# EasyEDA Pro project ProPrj_Xen_2025-02-04.epro, schematic Schematic1_2

## Sheets
1 Multiplex: Board Name: XenController; Create Date: 2024-12-16; Page Name: Multiplex; Project Name: Xen; Schematic Name: Schematic1; Update Date: 2024-12-22; Company: EasyEDA.com; Drawn: EasyEDA; Page Size: A4; Part Number: JLCPCB-002; Reviewed: EasyEDA; Version: V0.1
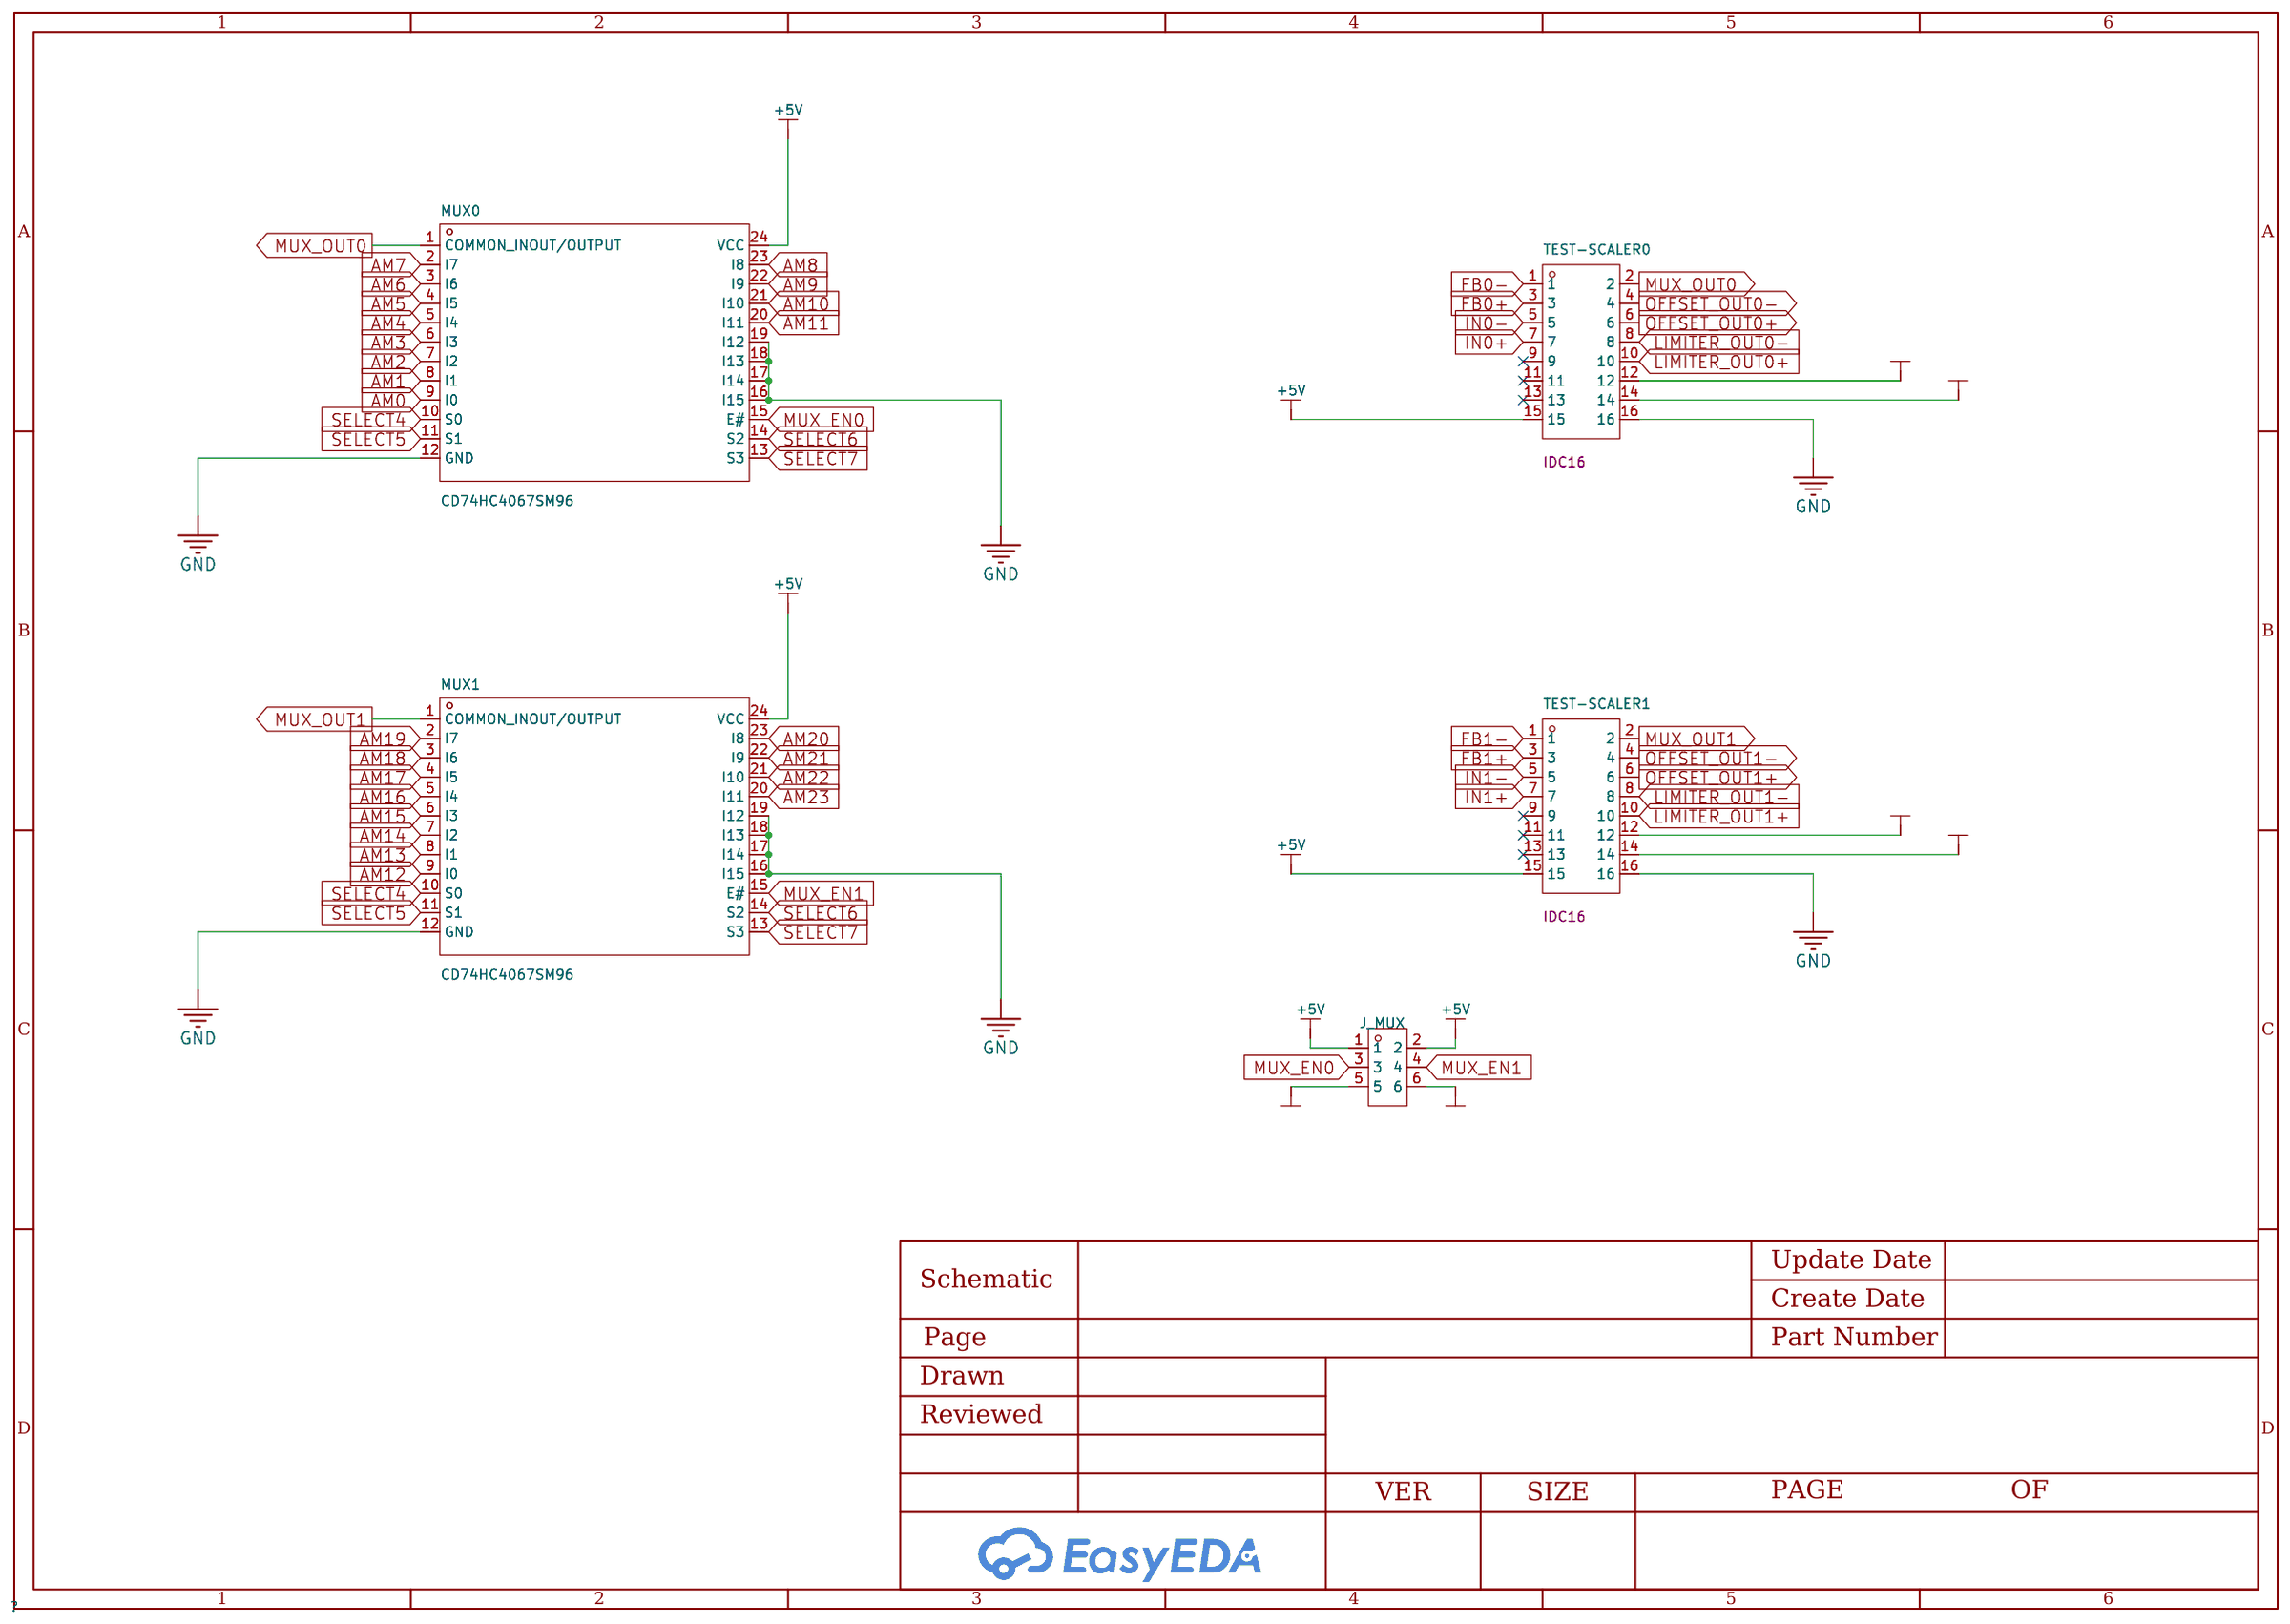
[diagram p0: Multiplex]
2 Scaler: Board Name: XenScaler; Page Name: Scaler
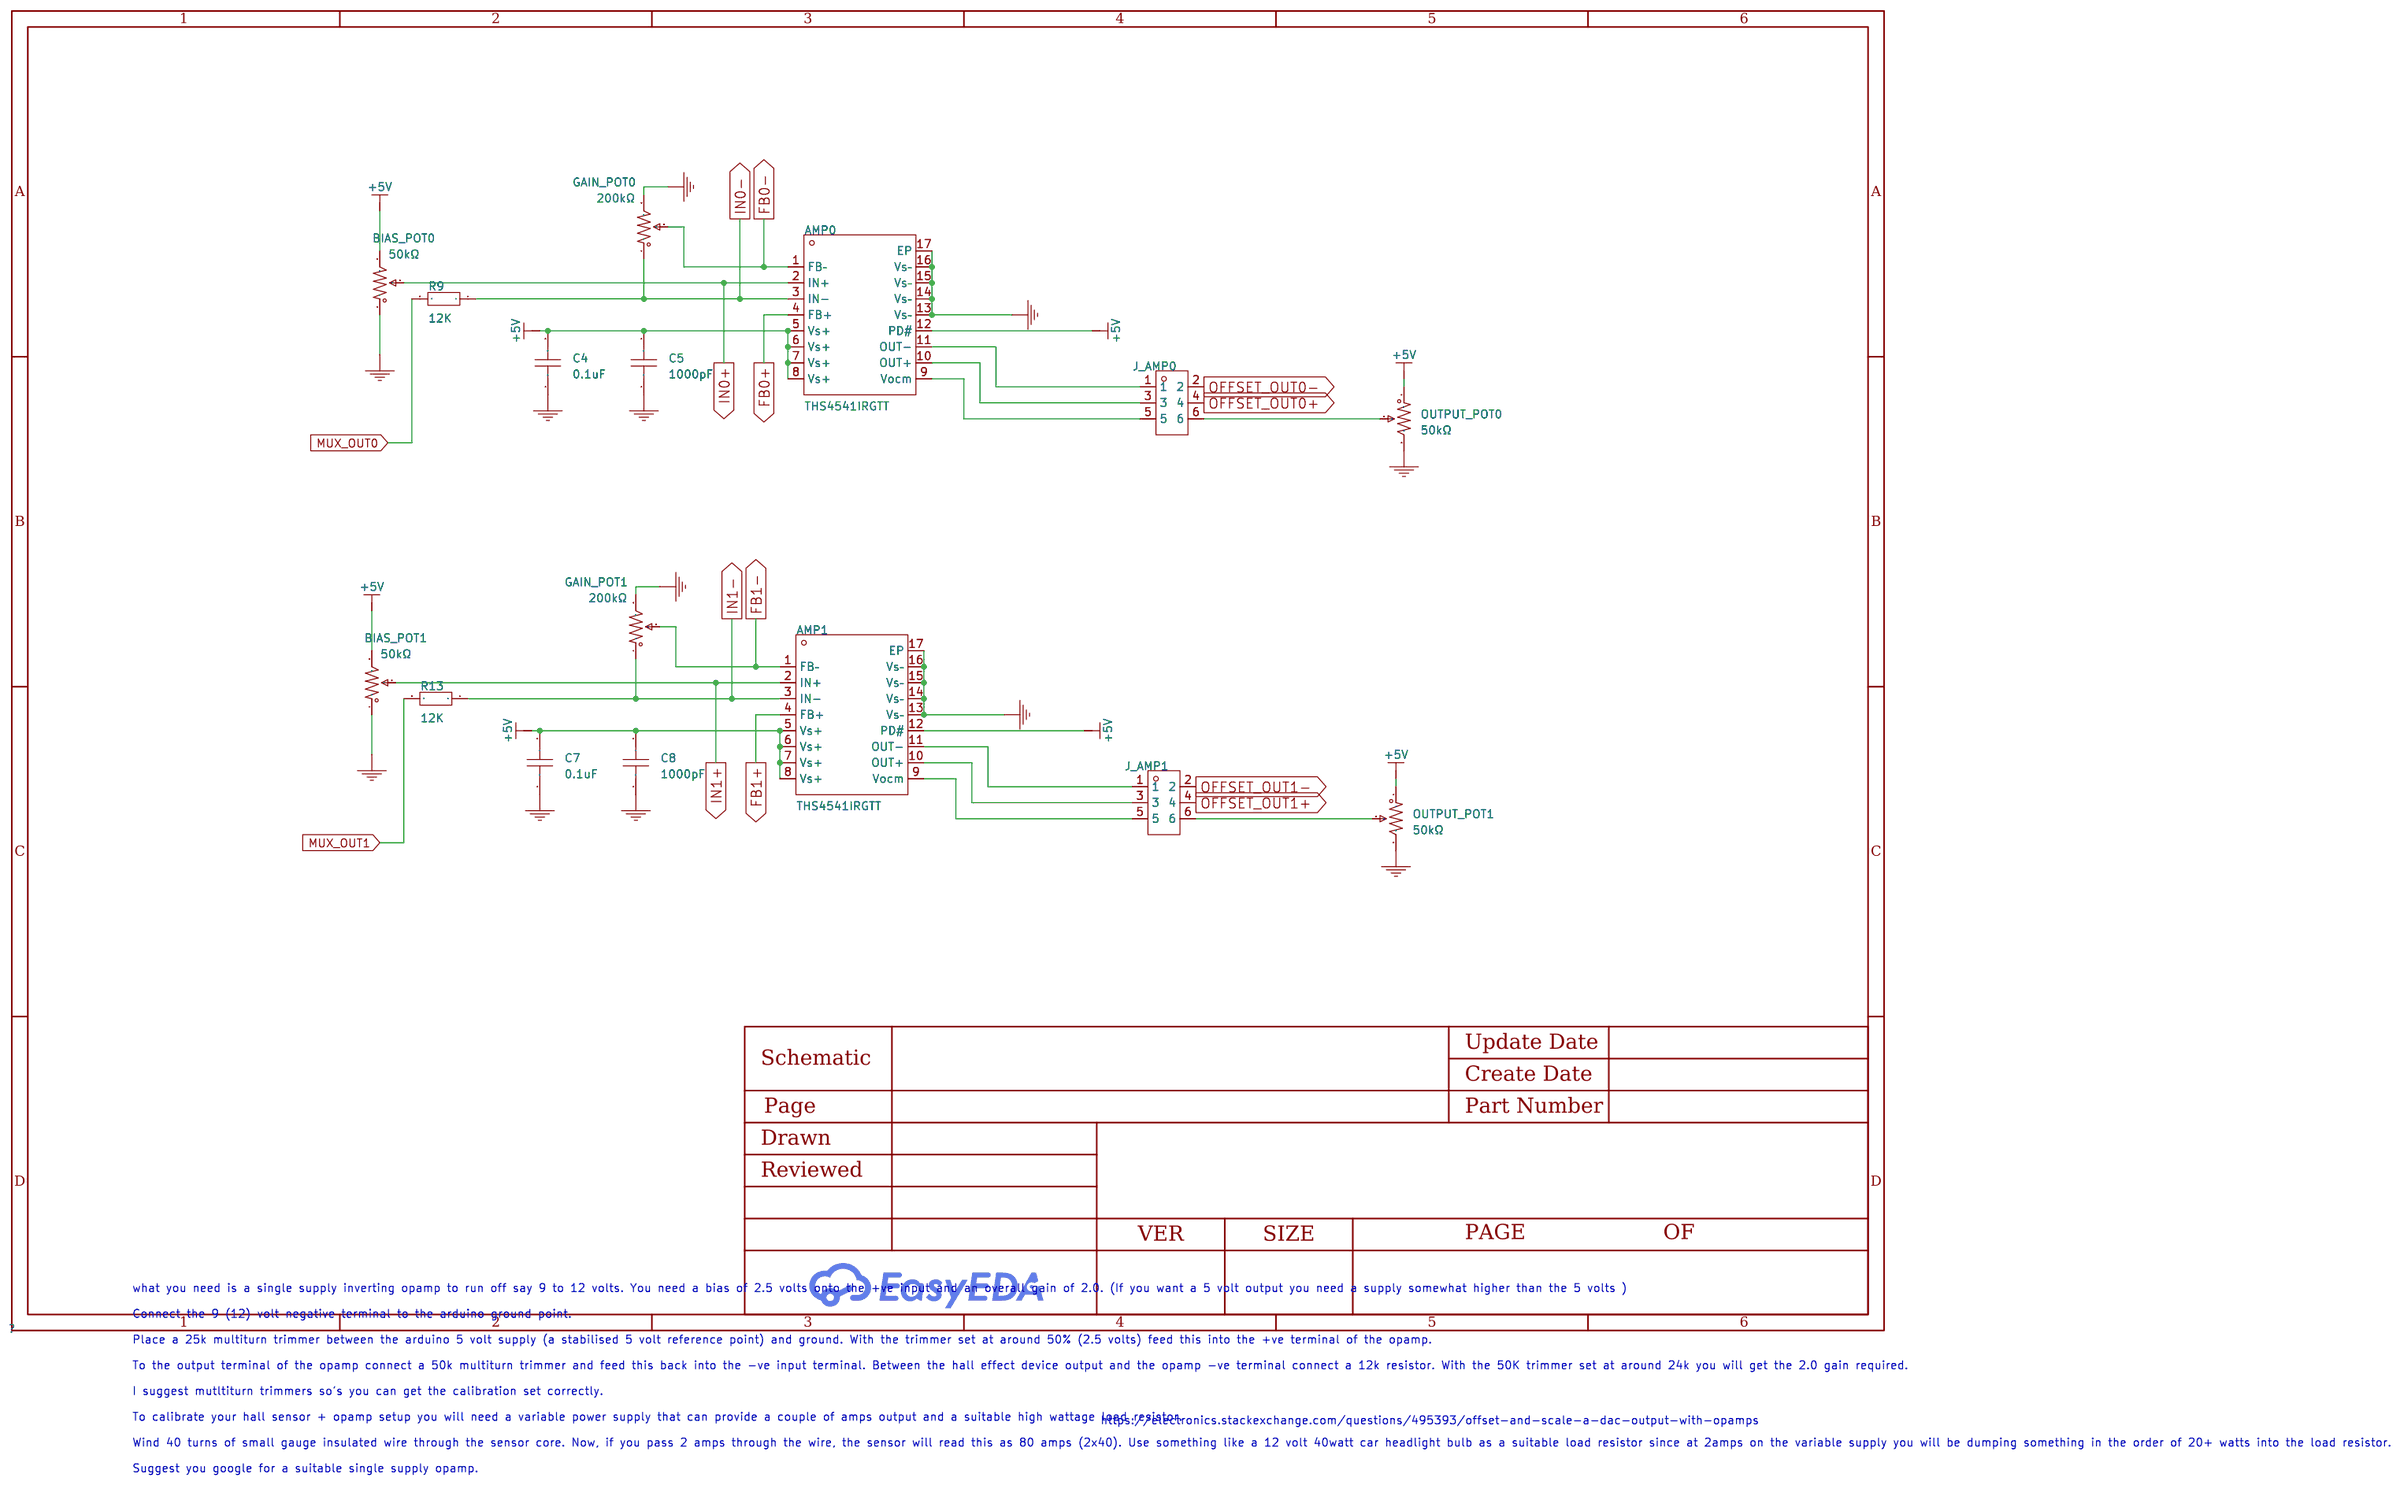
[diagram p1: Scaler]
3 Limiter: Page Name: Limiter
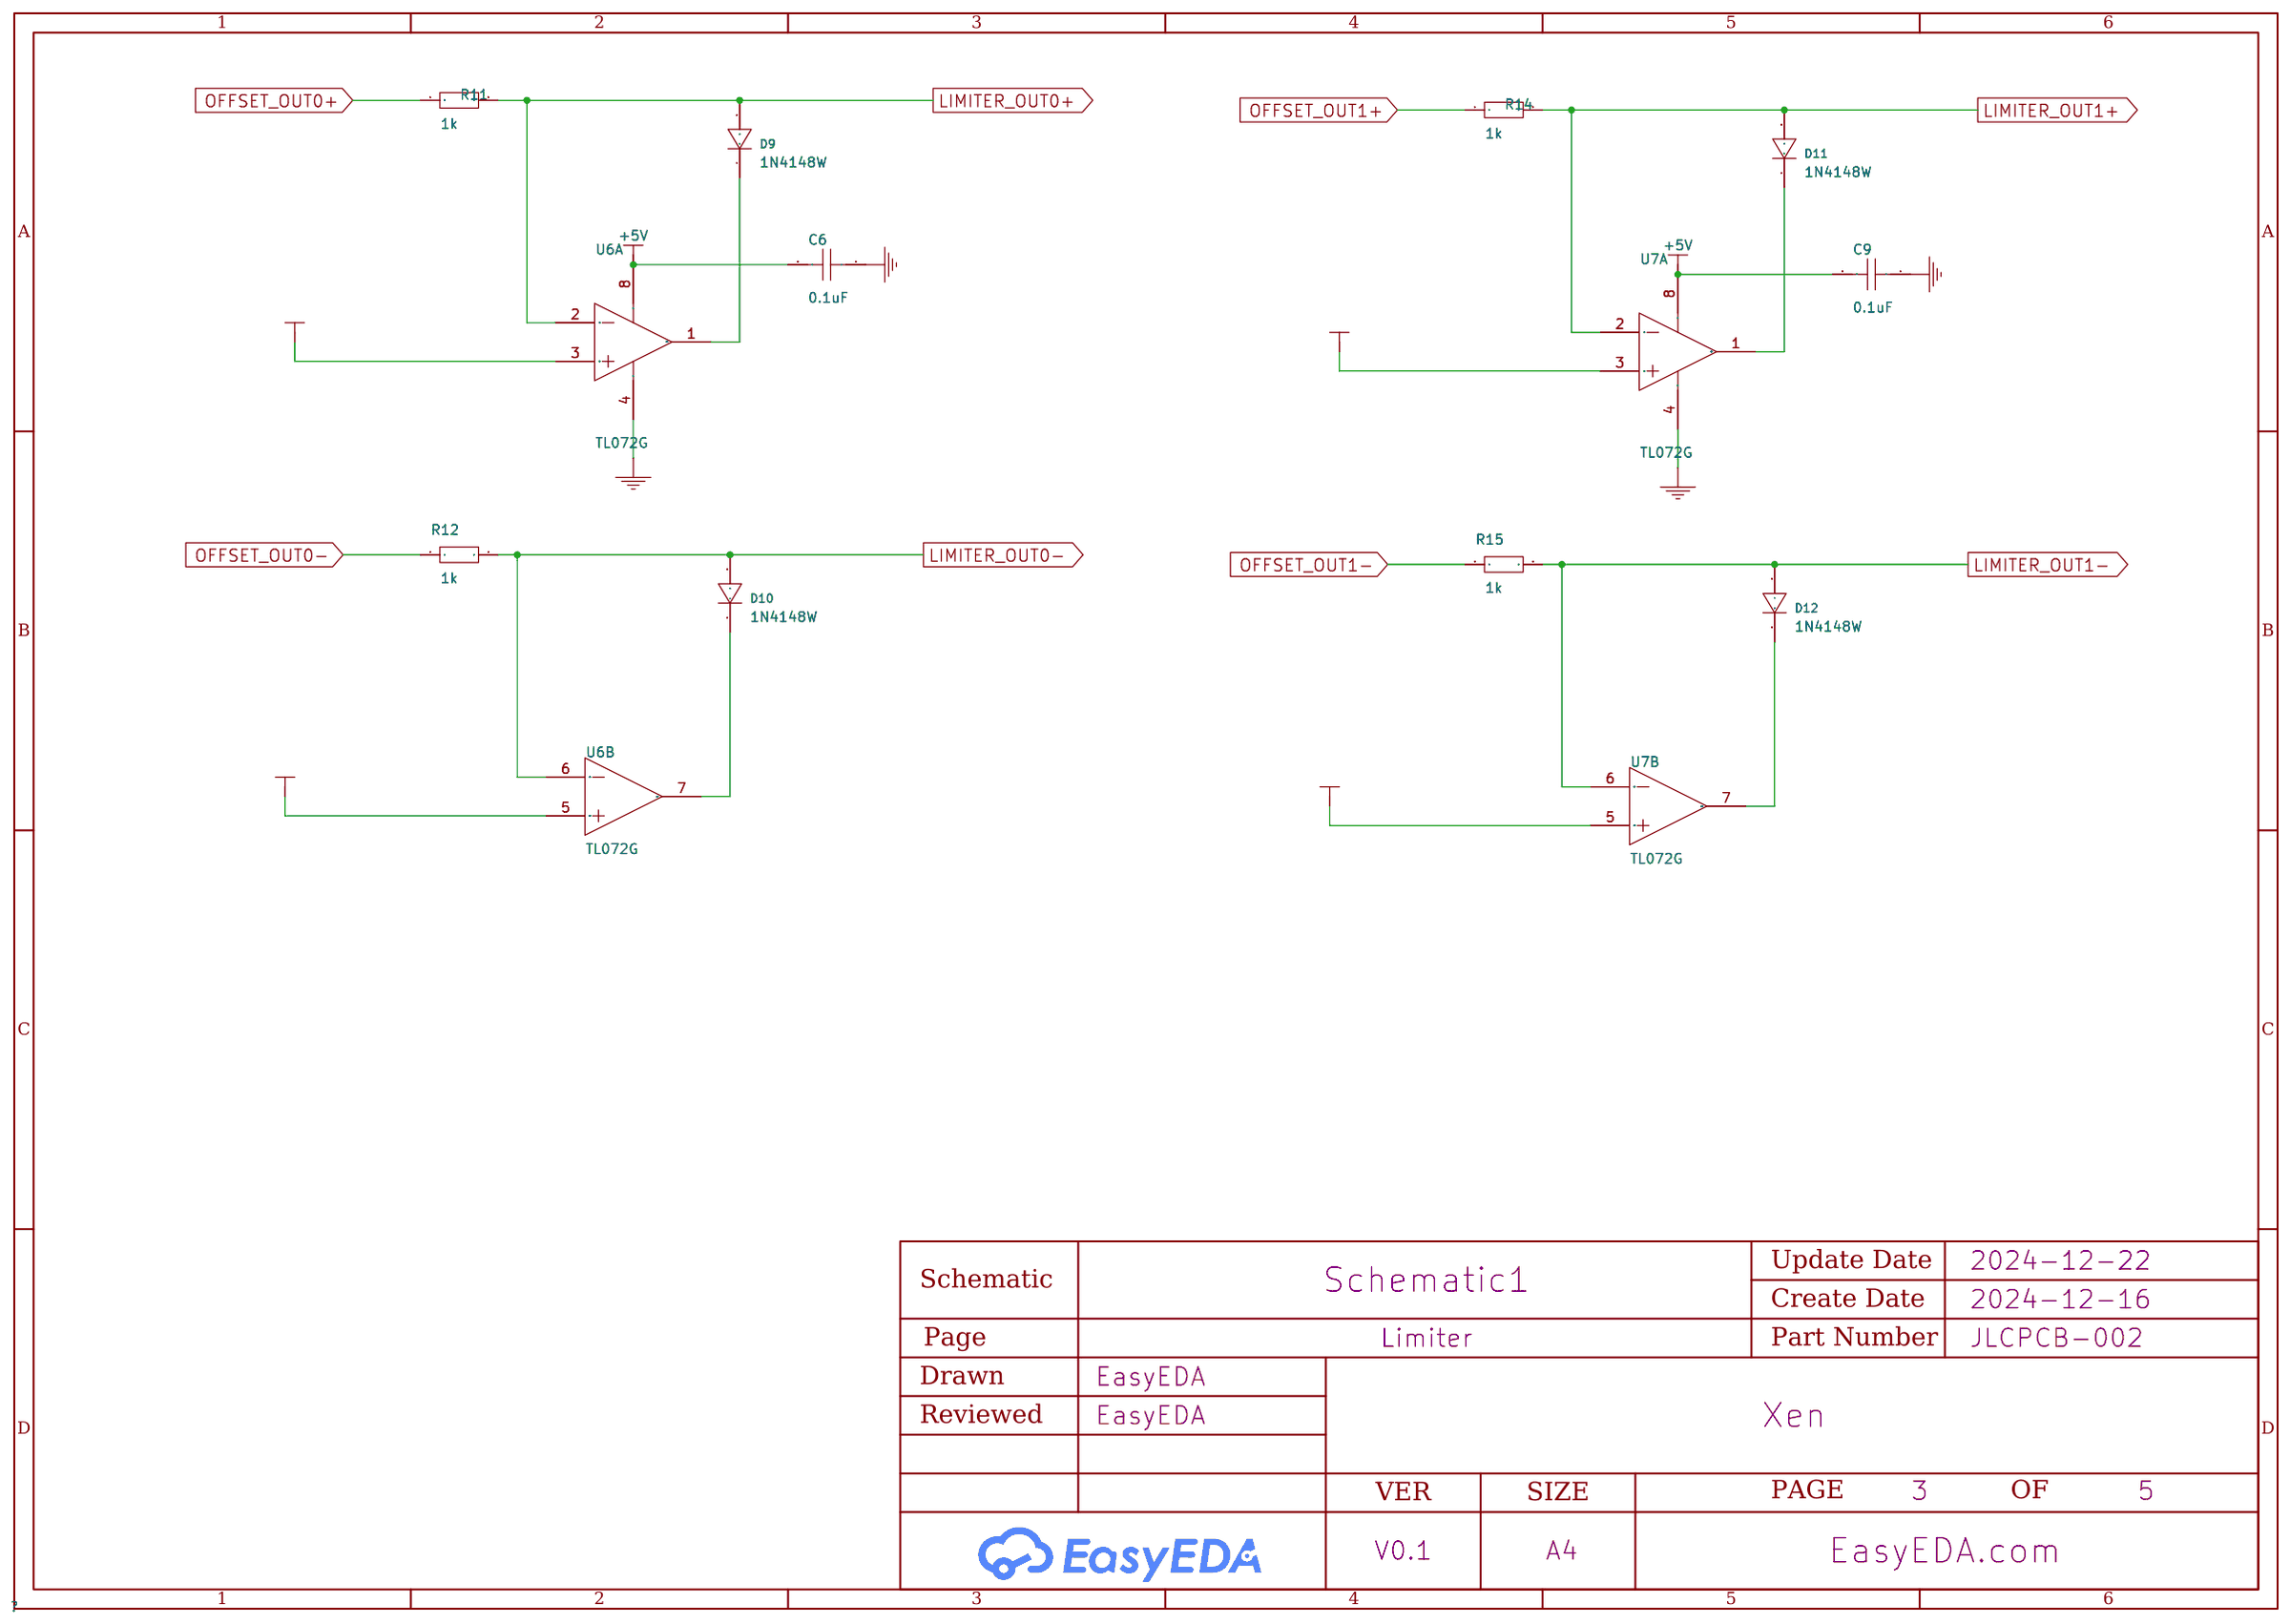
[diagram p2: Limiter]
4 Teensy: Create Date: 2024-12-22; Page Name: Teensy
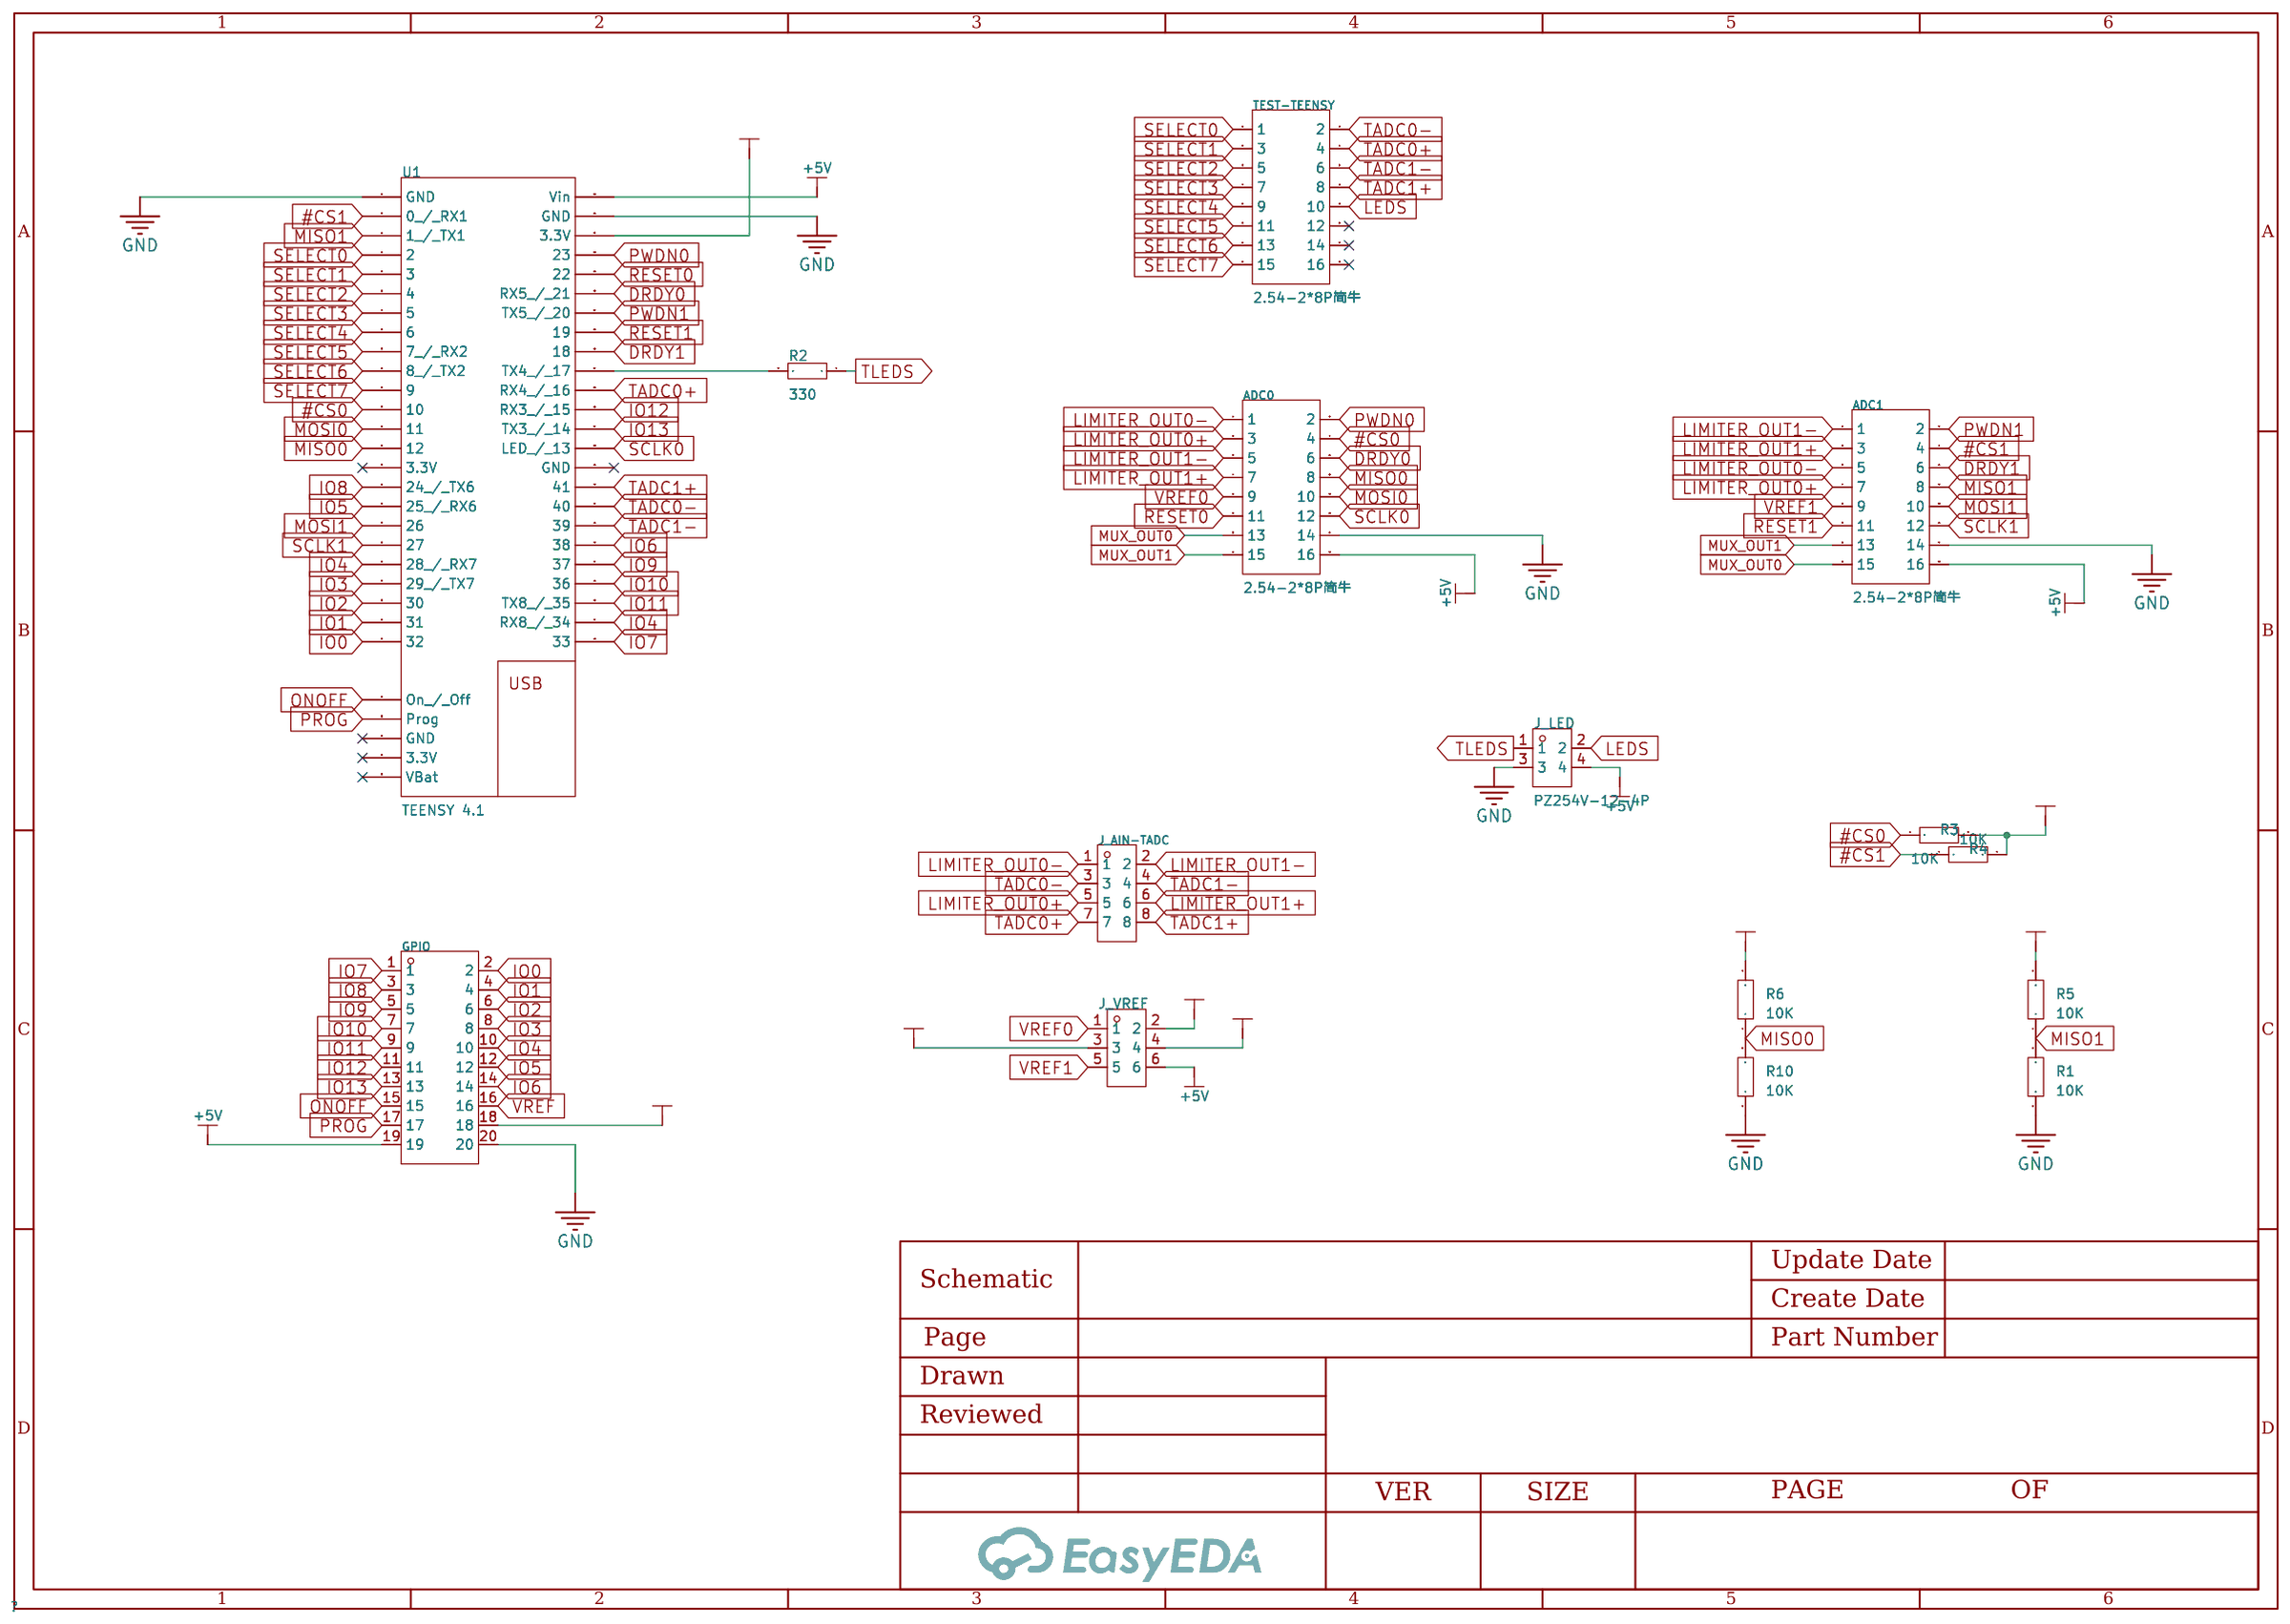
[diagram p3: Teensy]
5 Connects: Create Date: 2024-12-22; Page Name: Connects
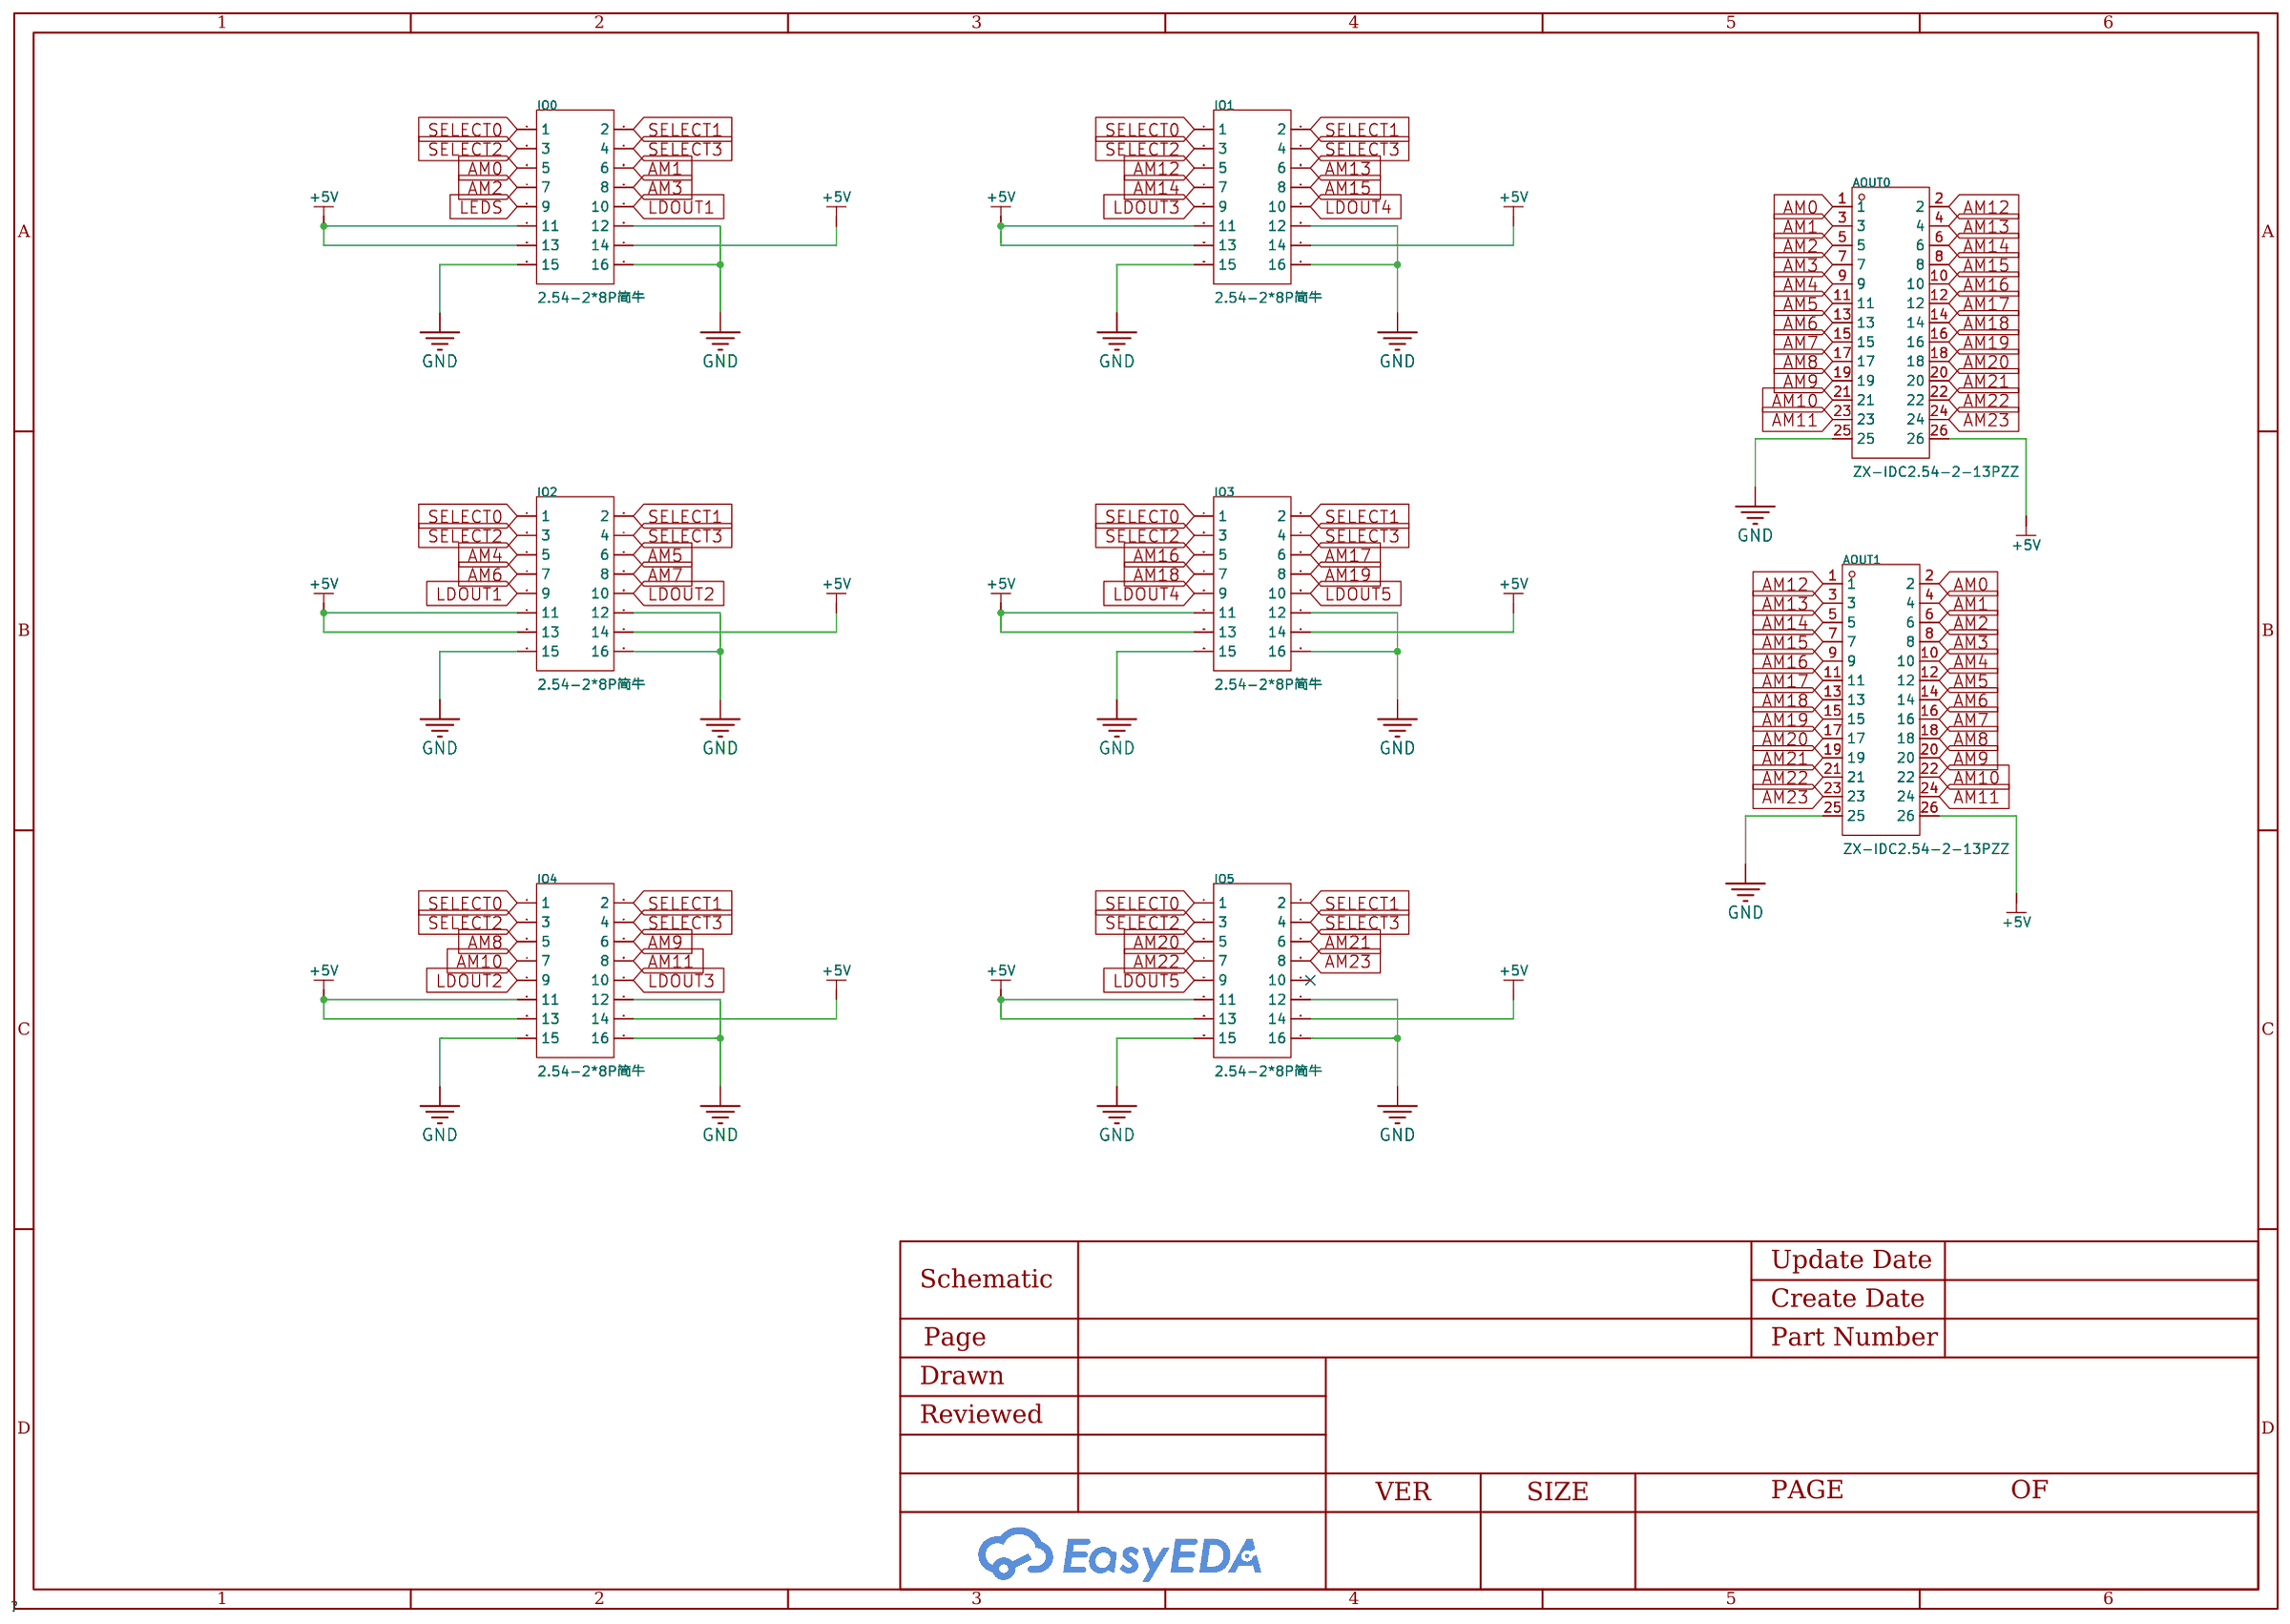
[diagram p4: Connects]

## Parts
sheet Connects
AOUT0  ZX-IDC2.54-2-13PZZ  [IDC-TH_26P-P2.54_ZX-IDC2.54-2-13PZZ]
AOUT1  ZX-IDC2.54-2-13PZZ  [IDC-TH_26P-P2.54_ZX-IDC2.54-2-13PZZ]
IO0  2.54-2*8P简牛  [IDC-TH_16P-P2.54_C3406]
IO1  2.54-2*8P简牛  [IDC-TH_16P-P2.54_C3406]
IO2  2.54-2*8P简牛  [IDC-TH_16P-P2.54_C3406]
IO3  2.54-2*8P简牛  [IDC-TH_16P-P2.54_C3406]
IO4  2.54-2*8P简牛  [IDC-TH_16P-P2.54_C3406]
IO5  2.54-2*8P简牛  [IDC-TH_16P-P2.54_C3406]
sheet Limiter
C6  0.1uF  [C0603]
C9  0.1uF  [C0603]
D9  1N4148W  [SOD-123F_L2.7-W1.6-LS3.8-RD]
D10  1N4148W  [SOD-123F_L2.7-W1.6-LS3.8-RD]
D11  1N4148W  [SOD-123F_L2.7-W1.6-LS3.8-RD]
D12  1N4148W  [SOD-123F_L2.7-W1.6-LS3.8-RD]
R11  1k  [R0603]
R12  1k  [R0603]
R14  1k  [R0603]
R15  1k  [R0603]
U6  TL072G  [SOIC-8_L4.9-W3.9-P1.27-LS6.0-BL]  (sections 1,2)
U7  TL072G  [SOIC-8_L4.9-W3.9-P1.27-LS6.0-BL]  (sections 1,2)
sheet Multiplex
J_MUX  ZX-PZ2.54-2-3PZZ  [HDR-TH_6P-P2.54-V-M-R2-C3-S2.54-1]
MUX0  CD74HC4067SM96  [SSOP-24_L8.1-W5.3-P0.65-LS7.8-BL]
MUX1  CD74HC4067SM96  [SSOP-24_L8.1-W5.3-P0.65-LS7.8-BL]
TEST-SCALER0  IDC16  [CONN-TH_16P-P2.54_TE_1761681-6]
TEST-SCALER1  IDC16  [CONN-TH_16P-P2.54_TE_1761681-6]
sheet Scaler
AMP0  THS4541IRGTT  [TQFN-16_L3.0-W3.0-P0.50-BL-EP1.5]
AMP1  THS4541IRGTT  [TQFN-16_L3.0-W3.0-P0.50-BL-EP1.5]
BIAS_POT0  50kΩ  [RES-ADJ-TH_3P-L9.5-W4.85-P2.50-BL-BS]
BIAS_POT1  50kΩ  [RES-ADJ-TH_3P-L9.5-W4.85-P2.50-BL-BS]
C4  0.1uF  [C0603]
C5  1000pF  [C0603]
C7  0.1uF  [C0603]
C8  1000pF  [C0603]
GAIN_POT0  200kΩ  [RES-ADJ-TH_3P-L9.5-W4.85-P2.50-BL-BS]
GAIN_POT1  200kΩ  [RES-ADJ-TH_3P-L9.5-W4.85-P2.50-BL-BS]
J_AMP0  ZX-PZ2.54-2-3PZZ  [HDR-TH_6P-P2.54-V-M-R2-C3-S2.54-1]
J_AMP1  ZX-PZ2.54-2-3PZZ  [HDR-TH_6P-P2.54-V-M-R2-C3-S2.54-1]
OUTPUT_POT0  50kΩ  [RES-ADJ-TH_3P-L9.5-W4.85-P2.50-BL-BS]
OUTPUT_POT1  50kΩ  [RES-ADJ-TH_3P-L9.5-W4.85-P2.50-BL-BS]
R9  12K  [R0603]
R13  12K  [R0603]
sheet Teensy
ADC0  2.54-2*8P简牛  [IDC-TH_16P-P2.54_C3406]
ADC1  2.54-2*8P简牛  [IDC-TH_16P-P2.54_C3406]
GPIO  ZX-IDC2.54-2-10PZZ  [IDC-TH_20P-P2.54_ZX-IDC2.54-2-10PZZ]
J_AIN-TADC  PZ2.54-2*4  [HDR-TH_8P-P2.54-V-M-R2-C4-S2.54]
J_LED  PZ254V-12-4P  [HDR-TH_4P-P2.54-V-M-R2-C2-S2.54]
J_VREF  ZX-PZ2.54-2-3PZZ  [HDR-TH_6P-P2.54-V-M-R2-C3-S2.54-1]
R1  10K  [R0603]
R2  330  [R0603]
R3  10K  [R0603]
R4  10K  [R0603]
R5  10K  [R0603]
R6  10K  [R0603]
R10  10K  [R0603]
TEST-TEENSY  2.54-2*8P简牛  [IDC-TH_16P-P2.54_C3406]
U1  TEENSY 4.1  [TEENSY 4.1]

## Library data of the parts
AOUT0 AOUT1 = ZX-IDC2.54-2-13PZZ: Connector Type:简牛座 Pitch:2.54mm Structure:2x13P Current Rating (Max):3A Voltage Rating (Max):1kV Holder Type:Straight Row Spacing:2.54mm Number of Rows:2 Pin Number in each Row:13 Contact Material:Brass Contact Plating:Gold Operating Temperature Range:-40; LCSC Part Name: 2.54mm 2x13P 排数:2 每排P数:13; Supplier Part: C7501247; Manufacturer: Megastar(兆星); Supplier Footprint: 插件,P=2.54mm; JLCPCB Part Class: Extended Part; Datasheet: https://atta.szlcsc.com/upload/public/pdf/source/20231122/C34A0102EBF117114DD7A9F9DEFF8982.pdf; Supplier: LCSC; Connector Type: 简牛座; Pitch: 2.54mm; Structure: 2x13P; Current Rating (Max): 3A; Voltage Rating (Max): 1kV; Holder Type: Straight; Row Spacing: 2.54mm; Number of Rows: 2; Pin Number in each Row: 13; Contact Material: Brass; Contact Plating: Gold; Operating Temperature Range: -40℃~+105℃; Soldering Temperature(Max): 260℃@10S
ADC0 ADC1 IO0-IO5 TEST-TEENSY = 2.54-2*8P简牛: Connector Type:简牛座 Pitch:2.54mm Structure:2x8P Holder Type:Straight Row Spacing:2.54mm Number of Rows:2 Pin Number in each Row:8 Contact Material:- Contact Plating:-; LCSC Part Name: 2.54mm 2x8P 排数:2 每排P数:8; Supplier Part: C3406; Manufacturer: BOOMELE(博穆精密); Supplier Footprint: 插件,P=2.54mm; JLCPCB Part Class: Extended Part; Datasheet: https://atta.szlcsc.com/upload/public/pdf/source/20131122/1457706661483.pdf; Supplier: LCSC; Connector Type: 简牛座; Pitch: 2.54mm; Structure: 2x8P; Holder Type: Straight; Row Spacing: 2.54mm; Number of Rows: 2; Pin Number in each Row: 8
C4-C9 = CAP_0603: Supplier Footprint: 0603
D9-D12 = 1N4148W_C81598: Diode Configuration: Forward Voltage (Vf@If):1V@50mA Reverse Voltage (Vr): Average Rectified Current (Io): Power Dissipation: Reverse Leakage Current:1uA@75V Reverse Recovery Time (trr): Operating Temperature:- Operating Temperature:-; LCSC Part Name: 电压:75V 电流:150mA; Supplier Part: C81598; Manufacturer: ST(先科); Supplier Footprint: SOD-123; JLCPCB Part Class: Basic Part; Datasheet: https://atta.szlcsc.com/upload/public/pdf/source/20161024/1477288446905.pdf; Supplier: LCSC; Forward Voltage (Vf@If): 1V@50mA; Reverse Leakage Current: 1uA@75V
R1-R6 R9-R15 = Res_0603: Supplier Footprint: 0603
U6 U7 = TL072G: Supplier Part: C108153; Manufacturer: UTC(友顺); Supplier Footprint: SOP-8; JLCPCB Part Class: Extended Part; Datasheet: https://atta.szlcsc.com/upload/public/pdf/source/20230725/F7A3AE6E172D192144D158C404D929C8.pdf; Supplier: LCSC
J_AMP0 J_AMP1 J_MUX J_VREF = ZX-PZ2.54-2-3PZZ: Pin Structure:2x3P Pitch:2.54mm Row Spacing:2.54mm Circluar Pins/Square Pins:Square Pins Mounting Type:Straight Number of Rows:双排 Number of Pins:6P Current Rating (Max):3A Voltage Rating (Max):1kV Length of Mating Pin:6mm Insulation Height:2.5mm Length of; LCSC Part Name: 2x3P 间距:2.54mm 方针 直插; Supplier Part: C7501274; Manufacturer: Megastar(兆星); Supplier Footprint: 插件,P=2.54mm; JLCPCB Part Class: Extended Part; Datasheet: https://atta.szlcsc.com/upload/public/pdf/source/20231122/E8390501A702A71E626C593F036B3607.pdf; Supplier: LCSC; Pin Structure: 2x3P; Pitch: 2.54mm; Row Spacing: 2.54mm; Circluar Pins/Square Pins: Square Pins; Mounting Type: Straight; Number of Rows: 双排; Number of Pins: 6P; Current Rating (Max): 3A; Voltage Rating (Max): 1kV; Length of Mating Pin: 6mm; Insulation Height: 2.5mm; Length of End Connection Pin: 3mm; Contact Plating: Gold; Operating Temperature Range: -40℃~+105℃; Color: Black
MUX0 MUX1 = CD74HC4067SM96: Switch Circuit:- Number of Channels:16 Supply Voltage:2V~6V Supply Voltage:2V~6V Turn-on time:90ns On-State Resistance (Max):240Ω Turn-off time:87ns Operating Temperature:-55℃~+125℃ Operating Temperature:-55℃~+125℃; LCSC Part Name: 高速CMOS逻辑16通道模拟多路复用器/解复用器; Supplier Part: C98457; Manufacturer: TI(德州仪器); Supplier Footprint: SSOP-24-208mil; JLCPCB Part Class: Extended Part; Datasheet: https://www.ti.com/cn/lit/gpn/cd74hc4067; Supplier: LCSC; Number of Channels: 16; Supply Voltage: 2V~6V; Turn-on time: 90ns; On-State Resistance (Max): 240Ω; Turn-off time: 87ns; Operating Temperature: -55℃~+125℃
TEST-SCALER0 TEST-SCALER1 = HC-JN254-2-08-Z: Connector Type:简牛座 Pitch:2.54mm Structure:2x8P Current Rating (Max):3A Holder Type:Straight Row Spacing:2.54mm Number of Rows:2 Pin Number in each Row:8 Contact Material:Brass Contact Plating:Gold Operating Temperature Range:-40℃~+105℃ Operating Temperatu; LCSC Part Name: 2.54mm 2x8P 排数:2 每排P数:8; Supplier Part: C5372867; Manufacturer: HCTL(华灿天禄); Supplier Footprint: 插件,P=2.54mm; JLCPCB Part Class: Extended Part; Datasheet: https://atta.szlcsc.com/upload/public/pdf/source/20230316/69505B1ED1C4E6AD1FC7E030884C6E9A.pdf; Supplier: LCSC; Connector Type: 简牛座; Pitch: 2.54mm; Structure: 2x8P; Current Rating (Max): 3A; Holder Type: Straight; Row Spacing: 2.54mm; Number of Rows: 2; Pin Number in each Row: 8; Contact Material: Brass; Contact Plating: Gold; Operating Temperature Range: -40℃~+105℃; Soldering Temperature(Max): 260℃@10S
AMP0 AMP1 = THS4541IRGTT: Supplier Part: C2058382; Manufacturer: TI(德州仪器); Supplier Footprint: VQFN-16-EP(3x3); JLCPCB Part Class: Extended Part; Datasheet: https://www.ti.com/cn/lit/gpn/ths4541; Supplier: LCSC
BIAS_POT0 BIAS_POT1 OUTPUT_POT0 OUTPUT_POT1 = 3296W-1-503: Resistance: Tolerance:±10% Tolerance:±10%; LCSC Part Name: 50kΩ ±10%; Supplier Part: C118911; Manufacturer: BOCHEN(博晨); Supplier Footprint: 插件; JLCPCB Part Class: Extended Part; Datasheet: https://atta.szlcsc.com/upload/public/pdf/source/20171114/C118911_15106326557211117401.pdf; Supplier: LCSC; Tolerance: ±10%
GAIN_POT0 GAIN_POT1 = 3296W-1-204_C118942: Resistance: Tolerance:±10% Tolerance:±10%; LCSC Part Name: 200kΩ ±10%; Supplier Part: C118942; Manufacturer: BOCHEN(博晨); Manufacturer Part: 3296W-1-204; Supplier Footprint: 插件; JLCPCB Part Class: Extended Part; Datasheet: https://atta.szlcsc.com/upload/public/pdf/source/20171114/C118942_15106326621411117431.pdf; Supplier: LCSC; Tolerance: ±10%
GPIO = ZX-IDC2.54-2-10PZZ: Connector Type:简牛座 Pitch:2.54mm Structure:2x10P Current Rating (Max):3A Voltage Rating (Max):1kV Holder Type:Straight Row Spacing:2.54mm Number of Rows:2 Pin Number in each Row:10 Contact Material:Brass Contact Plating:Gold Operating Temperature Range:-40; LCSC Part Name: 2.54mm 2x10P 排数:2 每排P数:10; Supplier Part: C7501245; Manufacturer: Megastar(兆星); Supplier Footprint: 插件,P=2.54mm; JLCPCB Part Class: Extended Part; Datasheet: https://atta.szlcsc.com/upload/public/pdf/source/20231122/326051A7BAD0E01EBB3DBE8FB30DA5B7.pdf; Supplier: LCSC; Connector Type: 简牛座; Pitch: 2.54mm; Structure: 2x10P; Current Rating (Max): 3A; Voltage Rating (Max): 1kV; Holder Type: Straight; Row Spacing: 2.54mm; Number of Rows: 2; Pin Number in each Row: 10; Contact Material: Brass; Contact Plating: Gold; Operating Temperature Range: -40℃~+105℃; Soldering Temperature(Max): 260℃@10S
J_AIN-TADC = PZ2.54-2*4: Pin Structure:2x4P Pitch:2.54mm Number of Rows:双排 Number of Pins:8P; Supplier Part: C5156676; Manufacturer: ZHOURI(洲日); Supplier Footprint: 插件,P=2.54mm; JLCPCB Part Class: Extended Part; Datasheet: https://atta.szlcsc.com/upload/public/pdf/source/20220923/0E7A4A94740FFD503E2D73F36F92C1EA.pdf; Supplier: LCSC; Pin Structure: 2x4P; Pitch: 2.54mm; Number of Rows: 双排; Number of Pins: 8P
J_LED = PZ254V-12-4P: Pin Structure:2x2P Pitch:2.54mm Row Spacing:2.54mm Circluar Pins/Square Pins:Square Pins Mounting Type:Straight Number of Rows:双排 Number of Pins:4P Current Rating (Max):- Voltage Rating (Max):- Length of Mating Pin:6mm Insulation Height:2.5mm Length of En; LCSC Part Name: 间距:2.54mm 2x2P 直插 方针; Supplier Part: C492419; Manufacturer: XFCN(兴飞); Supplier Footprint: 插件,P=2.54mm; JLCPCB Part Class: Extended Part; Datasheet: https://atta.szlcsc.com/upload/public/pdf/source/20200309/C492419_0001C06E73AFF21BD0ED3D7CEEF46D29.pdf; Supplier: LCSC; Pin Structure: 2x2P; Pitch: 2.54mm; Row Spacing: 2.54mm; Circluar Pins/Square Pins: Square Pins; Mounting Type: Straight; Number of Rows: 双排; Number of Pins: 4P; Length of Mating Pin: 6mm; Insulation Height: 2.5mm; Length of End Connection Pin: 3mm; Operating Temperature Range: -40℃~+105℃; Color: Black
U1 = TEENSY 4.1

## Nets
+3.3V: GPIO.18 J_VREF.2 R3.2 R4.2 R5.2 R6.2 TEST-SCALER0.14 TEST-SCALER1.14 U1.27(3.3V)
+5V: ADC0.16 ADC1.16 AMP0.5(Vs+) AMP0.6(Vs+) AMP0.7(Vs+) AMP0.8(Vs+) AMP0.12(PD#) AMP1.5(Vs+) AMP1.6(Vs+) AMP1.7(Vs+) AMP1.8(Vs+) AMP1.12(PD#) AOUT0.26 AOUT1.26 BIAS_POT0.3 BIAS_POT1.3 C4.2 C5.2 C6.2 C7.2 C8.2 C9.2 GPIO.19 IO0.11 IO0.13 IO0.14 IO1.11 IO1.13 IO1.14 IO2.11 IO2.13 IO2.14 IO3.11 IO3.13 IO3.14 IO4.11 IO4.13 IO4.14 IO5.11 IO5.13 IO5.14 J_LED.4 J_MUX.1 J_MUX.2 J_VREF.6 MUX0.24(VCC) MUX1.24(VCC) OUTPUT_POT0.1 OUTPUT_POT1.1 TEST-SCALER0.15 TEST-SCALER1.15 U1.25(Vin) U6.8(VCC) U7.8(VCC)
GND: ADC0.14 ADC1.14 AMP0.13(Vs–) AMP0.14(Vs–) AMP0.15(Vs–) AMP0.16(Vs–) AMP0.17(EP) AMP1.13(Vs–) AMP1.14(Vs–) AMP1.15(Vs–) AMP1.16(Vs–) AMP1.17(EP) AOUT0.25 AOUT1.25 BIAS_POT0.1 BIAS_POT1.1 C4.1 C5.1 C6.1 C7.1 C8.1 C9.1 GAIN_POT0.3 GAIN_POT1.3 GPIO.20 IO0.12 IO0.15 IO0.16 IO1.12 IO1.15 IO1.16 IO2.12 IO2.15 IO2.16 IO3.12 IO3.15 IO3.16 IO4.12 IO4.15 IO4.16 IO5.12 IO5.15 IO5.16 J_LED.3 J_MUX.5 J_MUX.6 MUX0.12(GND) MUX0.16(I15) MUX0.17(I14) MUX0.18(I13) MUX0.19(I12) MUX1.12(GND) MUX1.16(I15) MUX1.17(I14) MUX1.18(I13) MUX1.19(I12) OUTPUT_POT0.3 OUTPUT_POT1.3 R1.1 R10.1 TEST-SCALER0.16 TEST-SCALER1.16 U1.1(GND) U1.26(GND) U6.4(VEE) U7.4(VEE)
#CS0: ADC0.4 R3.1 U1.12(10)
#CS1: ADC1.4 R4.1 U1.2(0 / RX1)
AM0: AOUT0.1 AOUT1.2 IO0.5 MUX0.9(I0)
AM1: AOUT0.3 AOUT1.4 IO0.6 MUX0.8(I1)
AM2: AOUT0.5 AOUT1.6 IO0.7 MUX0.7(I2)
AM3: AOUT0.7 AOUT1.8 IO0.8 MUX0.6(I3)
AM4: AOUT0.9 AOUT1.10 IO2.5 MUX0.5(I4)
AM5: AOUT0.11 AOUT1.12 IO2.6 MUX0.4(I5)
AM6: AOUT0.13 AOUT1.14 IO2.7 MUX0.3(I6)
AM7: AOUT0.15 AOUT1.16 IO2.8 MUX0.2(I7)
AM8: AOUT0.17 AOUT1.18 IO4.5 MUX0.23(I8)
AM9: AOUT0.19 AOUT1.20 IO4.6 MUX0.22(I9)
AM10: AOUT0.21 AOUT1.22 IO4.7 MUX0.21(I10)
AM11: AOUT0.23 AOUT1.24 IO4.8 MUX0.20(I11)
AM12: AOUT0.2 AOUT1.1 IO1.5 MUX1.9(I0)
AM13: AOUT0.4 AOUT1.3 IO1.6 MUX1.8(I1)
AM14: AOUT0.6 AOUT1.5 IO1.7 MUX1.7(I2)
AM15: AOUT0.8 AOUT1.7 IO1.8 MUX1.6(I3)
AM16: AOUT0.10 AOUT1.9 IO3.5 MUX1.5(I4)
AM17: AOUT0.12 AOUT1.11 IO3.6 MUX1.4(I5)
AM18: AOUT0.14 AOUT1.13 IO3.7 MUX1.3(I6)
AM19: AOUT0.16 AOUT1.15 IO3.8 MUX1.2(I7)
AM20: AOUT0.18 AOUT1.17 IO5.5 MUX1.23(I8)
AM21: AOUT0.20 AOUT1.19 IO5.6 MUX1.22(I9)
AM22: AOUT0.22 AOUT1.21 IO5.7 MUX1.21(I10)
AM23: AOUT0.24 AOUT1.23 IO5.8 MUX1.20(I11)
DRDY0: ADC0.6 U1.30(RX5 / 21)
DRDY1: ADC1.6 U1.33(18)
FB0+: AMP0.4(FB+) TEST-SCALER0.3
FB0-: AMP0.1(FB–) GAIN_POT0.2 TEST-SCALER0.1
FB1+: AMP1.4(FB+) TEST-SCALER1.3
FB1-: AMP1.1(FB–) GAIN_POT1.2 TEST-SCALER1.1
IN0+: AMP0.2(IN+) BIAS_POT0.2 TEST-SCALER0.7
IN0-: AMP0.3(IN-) GAIN_POT0.1 R9.1 TEST-SCALER0.5
IN1+: AMP1.2(IN+) BIAS_POT1.2 TEST-SCALER1.7
IN1-: AMP1.3(IN-) GAIN_POT1.1 R13.1 TEST-SCALER1.5
IO0: GPIO.2 U1.24(32)
IO1: GPIO.4 U1.23(31)
IO2: GPIO.6 U1.22(30)
IO3: GPIO.8 U1.21(29 / TX7)
IO4: GPIO.10 U1.20(28 / RX7) U1.47(RX8 / 34)
IO5: GPIO.12 U1.17(25 / RX6)
IO6: GPIO.14 U1.43(38)
IO7: GPIO.1 U1.48(33)
IO8: GPIO.3 U1.16(24 / TX6)
IO9: GPIO.5 U1.44(37)
IO10: GPIO.7 U1.45(36)
IO11: GPIO.9 U1.46(TX8 / 35)
IO12: GPIO.11 U1.36(RX3 / 15)
IO13: GPIO.13 U1.37(TX3 / 14)
LDOUT1: IO0.10 IO2.9
LDOUT2: IO2.10 IO4.9
LDOUT3: IO1.9 IO4.10
LDOUT4: IO1.10 IO3.9
LDOUT5: IO3.10 IO5.9
LEDS: IO0.9 J_LED.2 TEST-TEENSY.10
LIMITER_OUT0+: ADC0.3 ADC1.7 D9.2(A) J_AIN-TADC.5 R11.2 TEST-SCALER0.10 U6.2(IN1-)
LIMITER_OUT0-: ADC0.1 ADC1.5 D10.2(A) J_AIN-TADC.1 R12.2 TEST-SCALER0.8 U6.6(IN2-)
LIMITER_OUT1+: ADC0.7 ADC1.3 D11.2(A) J_AIN-TADC.6 R14.2 TEST-SCALER1.10 U7.2(IN1-)
LIMITER_OUT1-: ADC0.5 ADC1.1 D12.2(A) J_AIN-TADC.2 R15.2 TEST-SCALER1.8 U7.6(IN2-)
MISO0: ADC0.8 R6.1 R10.2 U1.14(12)
MISO1: ADC1.8 R1.2 R5.1 U1.3(1 / TX1)
MOSI0: ADC0.10 U1.13(11)
MOSI1: ADC1.10 U1.18(26)
MUX_EN0: J_MUX.3 MUX0.15(E#)
MUX_EN1: J_MUX.4 MUX1.15(E#)
MUX_OUT0: ADC0.13 ADC1.15 MUX0.1(COMMON INOUT/OUTPUT) R9.2 TEST-SCALER0.2
MUX_OUT1: ADC0.15 ADC1.13 MUX1.1(COMMON INOUT/OUTPUT) R13.2 TEST-SCALER1.2
OFFSET_OUT0+: J_AMP0.4 R11.1 TEST-SCALER0.6
OFFSET_OUT0-: J_AMP0.2 R12.1 TEST-SCALER0.4
OFFSET_OUT1+: J_AMP1.4 R14.1 TEST-SCALER1.6
OFFSET_OUT1-: J_AMP1.2 R15.1 TEST-SCALER1.4
ONOFF: GPIO.15 U1.49(On / Off)
PROG: GPIO.17 U1.50(Prog)
PWDN0: ADC0.2 U1.28(23)
PWDN1: ADC1.2 U1.31(TX5 / 20)
RESET0: ADC0.11 U1.29(22)
RESET1: ADC1.11 U1.32(19)
SCLK0: ADC0.12 U1.38(LED / 13)
SCLK1: ADC1.12 U1.19(27)
SELECT0: IO0.1 IO1.1 IO2.1 IO3.1 IO4.1 IO5.1 TEST-TEENSY.1 U1.4(2)
SELECT1: IO0.2 IO1.2 IO2.2 IO3.2 IO4.2 IO5.2 TEST-TEENSY.3 U1.5(3)
SELECT2: IO0.3 IO1.3 IO2.3 IO3.3 IO4.3 IO5.3 TEST-TEENSY.5 U1.6(4)
SELECT3: IO0.4 IO1.4 IO2.4 IO3.4 IO4.4 IO5.4 TEST-TEENSY.7 U1.7(5)
SELECT4: MUX0.10(S0) MUX1.10(S0) TEST-TEENSY.9 U1.8(6)
SELECT5: MUX0.11(S1) MUX1.11(S1) TEST-TEENSY.11 U1.9(7 / RX2)
SELECT6: MUX0.14(S2) MUX1.14(S2) TEST-TEENSY.13 U1.10(8 / TX2)
SELECT7: MUX0.13(S3) MUX1.13(S3) TEST-TEENSY.15 U1.11(9)
TADC0+: J_AIN-TADC.7 TEST-TEENSY.4 U1.35(RX4 / 16)
TADC0-: J_AIN-TADC.3 TEST-TEENSY.2 U1.41(40)
TADC1+: J_AIN-TADC.8 TEST-TEENSY.8 U1.40(41)
TADC1-: J_AIN-TADC.4 TEST-TEENSY.6 U1.42(39)
TLEDS: J_LED.1 R2.1
VOCM: AMP0.9(Vocm) J_AMP0.5
VREF: GPIO.16 J_VREF.3 J_VREF.4 TEST-SCALER0.12 TEST-SCALER1.12 U6.3(IN1+) U6.5(IN2+) U7.3(IN1+) U7.5(IN2+)
VREF0: ADC0.9 J_VREF.1
VREF1: ADC1.9 J_VREF.5
$2N3272: J_AMP0.6 OUTPUT_POT0.2
$2N3817: AMP0.10(OUT+) J_AMP0.3
$2N3823: AMP0.11(OUT-) J_AMP0.1
$2N5156: AMP1.9(Vocm) J_AMP1.5
$2N5160: J_AMP1.6 OUTPUT_POT1.2
$2N5161: AMP1.10(OUT+) J_AMP1.3
$2N5162: AMP1.11(OUT-) J_AMP1.1
$3N891: D9.1(K) U6.1(OUT1)
$3N1715: D10.1(K) U6.7(OUT2)
$3N3373: D11.1(K) U7.1(OUT1)
$3N3374: D12.1(K) U7.7(OUT2)
$4N5866: R2.2 U1.34(TX4 / 17)

Not connected (* = marked no-connect by the designer): IO5 10*; TEST-SCALER0 9* 11* 13*; TEST-SCALER1 9* 11* 13*; TEST-TEENSY 12* 14* 16*; U1 15(3.3V)* 39(GND)* 51(GND)* 52(3.3V)* 53(VBat)*

## Notes on the sheets
sheet 2
- https://electronics.stackexchange.com/questions/495393/offset-and-scale-a-dac-output-with-opamps
- what you need is a single supply inverting opamp to run off say 9 to 12 volts. You need a bias of 2.5 volts onto the +ve input and an overall gain of 2.0. (If you want a 5 volt output you need a supply somewhat higher than the 5 volts )
  Connect the 9 (12) volt negative terminal to the arduino ground point.
  Place a 25k multiturn trimmer between the arduino 5 volt supply (a stabilised 5 volt reference point) and ground. With the trimmer set at around 50% (2.5 volts) feed this into the +ve terminal of the opamp.
  To the output terminal of the opamp connect a 50k multiturn trimmer and feed this back into the -ve input terminal. Between the hall effect device output and the opamp -ve terminal connect a 12k resistor. With the 50K trimmer set at around 24k you will get the 2.0 gain required.
  I suggest mutltiturn trimmers so's you can get the calibration set correctly.
  To calibrate your hall sensor + opamp setup you will need a variable power supply that can provide a couple of amps output and a suitable high wattage load resistor.
  Wind 40 turns of small gauge insulated wire through the sensor core. Now, if you pass 2 amps through the wire, the sensor will read this as 80 amps (2x40). Use something like a 12 volt 40watt car headlight bulb as a suitable load resistor since at 2amps on the variable supply you will be dumping something in the order of 20+ watts into the load resistor.
  Suggest you google for a suitable single supply opamp.
